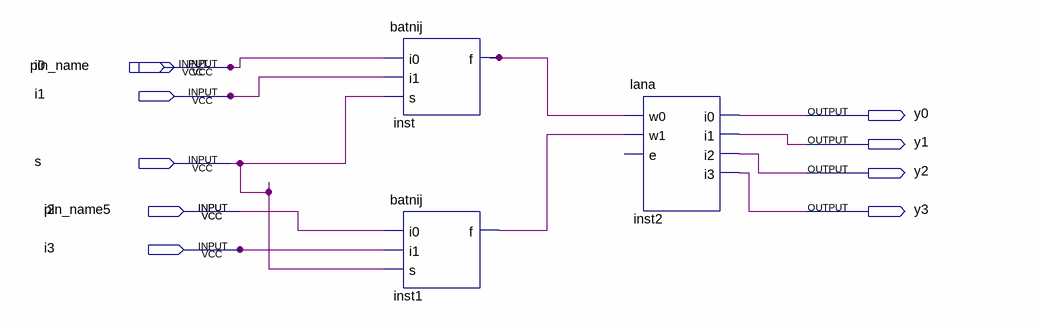
[diagram p0: schematic sheet]
// Quartus schematic system_one diagram.bdf as structural Verilog: 3 symbols, 11 pins
module \system_one_diagram  (
  input  pin_name,
  input  i0,
  input  i1,
  input  s,
  input  pin_name5,
  input  i2,
  input  i3,
  output y0,
  output y1,
  output y2,
  output y3
);

  wire inst1_f, inst_f;

  batnij inst (.i0(i0), .i1(i1), .s(s), .f(inst_f));
  batnij inst1 (.i0(i2), .i1(i3), .s(s), .f(inst1_f));
  lana inst2 (.w0(inst_f), .w1(inst1_f), .i0(y0), .i1(y1), .i2(y2), .i3(y3));  // open: e

  assign pin_name = i0;
  assign pin_name5 = i2;
endmodule
